# Altium schematic sheet Microcontroller_sch_v22_3.SchDoc
size 174 x 75 mm; Origin: Eagle
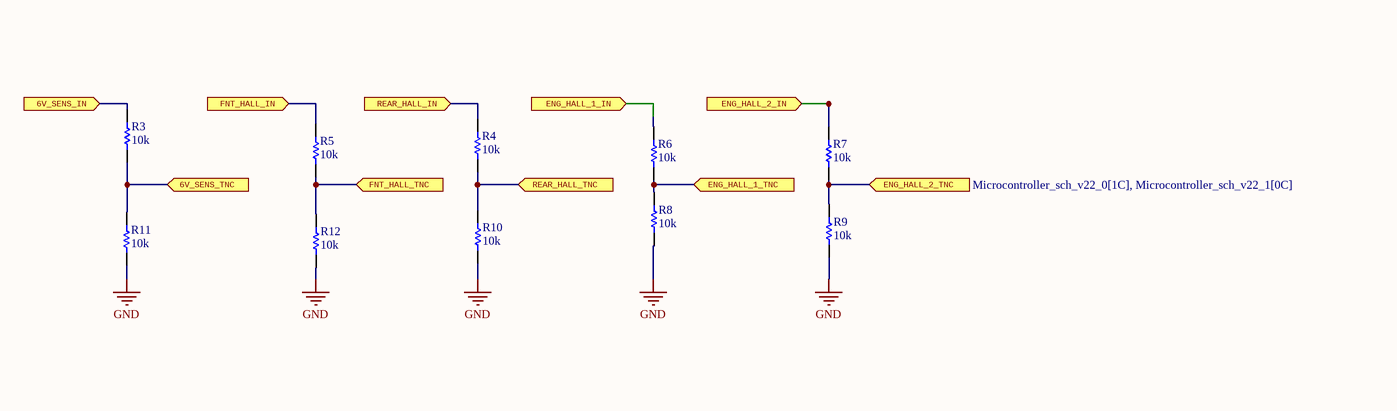
[diagram p0: Microcontroller_sch_v22_3.SchDoc]

## Parts
R3  10k  [RESC2013X50X30LL20T20]
R4  10k  [RESC2013X50X30LL20T20]
R5  10k  [RESC2013X50X30LL20T20]
R6  10k  [RESC2013X50X30LL20T20]
R7  10k  [RESC2013X50X30LL20T20]
R8  10k  [RESC2013X50X30LL20T20]
R9  10k  [RESC2013X50X30LL20T20]
R10  10k  [RESC2013X50X30LL20T20]
R11  10k  [RESC2013X50X30LL20T20]
R12  10k  [RESC2013X50X30LL20T20]

## Ports
6V_SENS_IN (in, see Microcontroller_sch_v22_2[2E]), 6V_SENS_TNC (in, see Microcontroller_sch_v22_1[2B]), ENG_HALL_1_IN (in, see Microcontroller_sch_v22_2[2D]), ENG_HALL_1_TNC (in, see Microcontroller_sch_v22_0[1C], Microcontroller_sch_v22_1[0C]), ENG_HALL_2_IN (in, see Microcontroller_sch_v22_2[2D]), ENG_HALL_2_TNC (in, see Microcontroller_sch_v22_0[1C], Microcontroller_sch_v22_1[0C]), FNT_HALL_IN (in, see Microcontroller_sch_v22_2[2D]), FNT_HALL_TNC (in, see Microcontroller_sch_v22_0[1C], Microcontroller_sch_v22_1[0B]), REAR_HALL_IN (in, see Microcontroller_sch_v22_2[2D]), REAR_HALL_TNC (in, see Microcontroller_sch_v22_0[1C], Microcontroller_sch_v22_1[0B])

## Nets
GND: R8.1 R9.1 R10.1 R11.1 R12.1
6V_SENS_IN: R3.2 ; port 6V_SENS_IN
6V_SENS_TNC: R3.1 R11.2 ; port 6V_SENS_TNC
ENG_HALL_1_IN: R6.2 ; port ENG_HALL_1_IN
ENG_HALL_1_TNC: R6.1 R8.2 ; port ENG_HALL_1_TNC
ENG_HALL_2_IN: R7.2 ; port ENG_HALL_2_IN
ENG_HALL_2_TNC: R7.1 R9.2 ; port ENG_HALL_2_TNC
FNT_HALL_IN: R5.2 ; port FNT_HALL_IN
FNT_HALL_TNC: R5.1 R12.2 ; port FNT_HALL_TNC
REAR_HALL_IN: R4.2 ; port REAR_HALL_IN
REAR_HALL_TNC: R4.1 R10.2 ; port REAR_HALL_TNC

## Library data of the parts
R3-R12 = CMP-2001-04896-1: Manufacturer: Vishay Dale; Part Number: CRCW08050000Z0EA